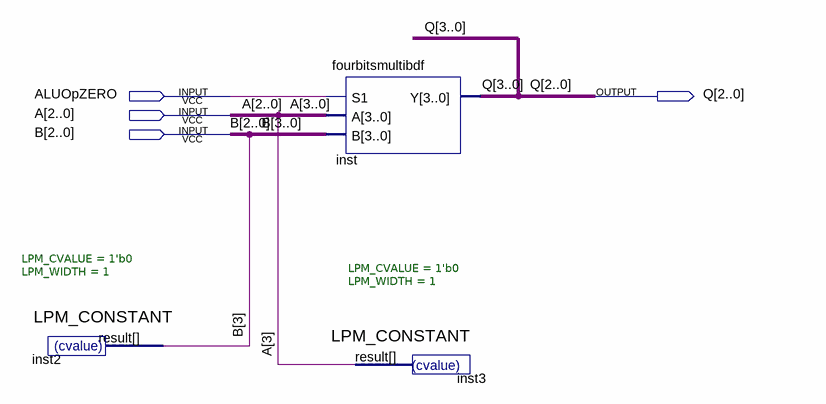
[diagram p0: schematic sheet]
// Quartus schematic threemul.bdf as structural Verilog: 3 symbols, 4 pins
module threemul (
  input  ALUOpZERO,
  input  [3:0] A,
  input  [3:0] B,
  output [3:0] Q
);

  LPM_CONSTANT #(.LPM_CVALUE(1'b0), .LPM_WIDTH(1)) inst2 (.result(B[3]));
  fourbitsmultibdf inst (.S1(ALUOpZERO), .A(A), .B(B), .Y(Q));
  LPM_CONSTANT #(.LPM_CVALUE(1'b0), .LPM_WIDTH(1)) inst3 (.result(A[3]));
endmodule
